# Altium schematic sheet 2020-10-26_19-15-181.schdoc
size 425 x 137 mm; SheetNumber: 1; SheetTotal: 1
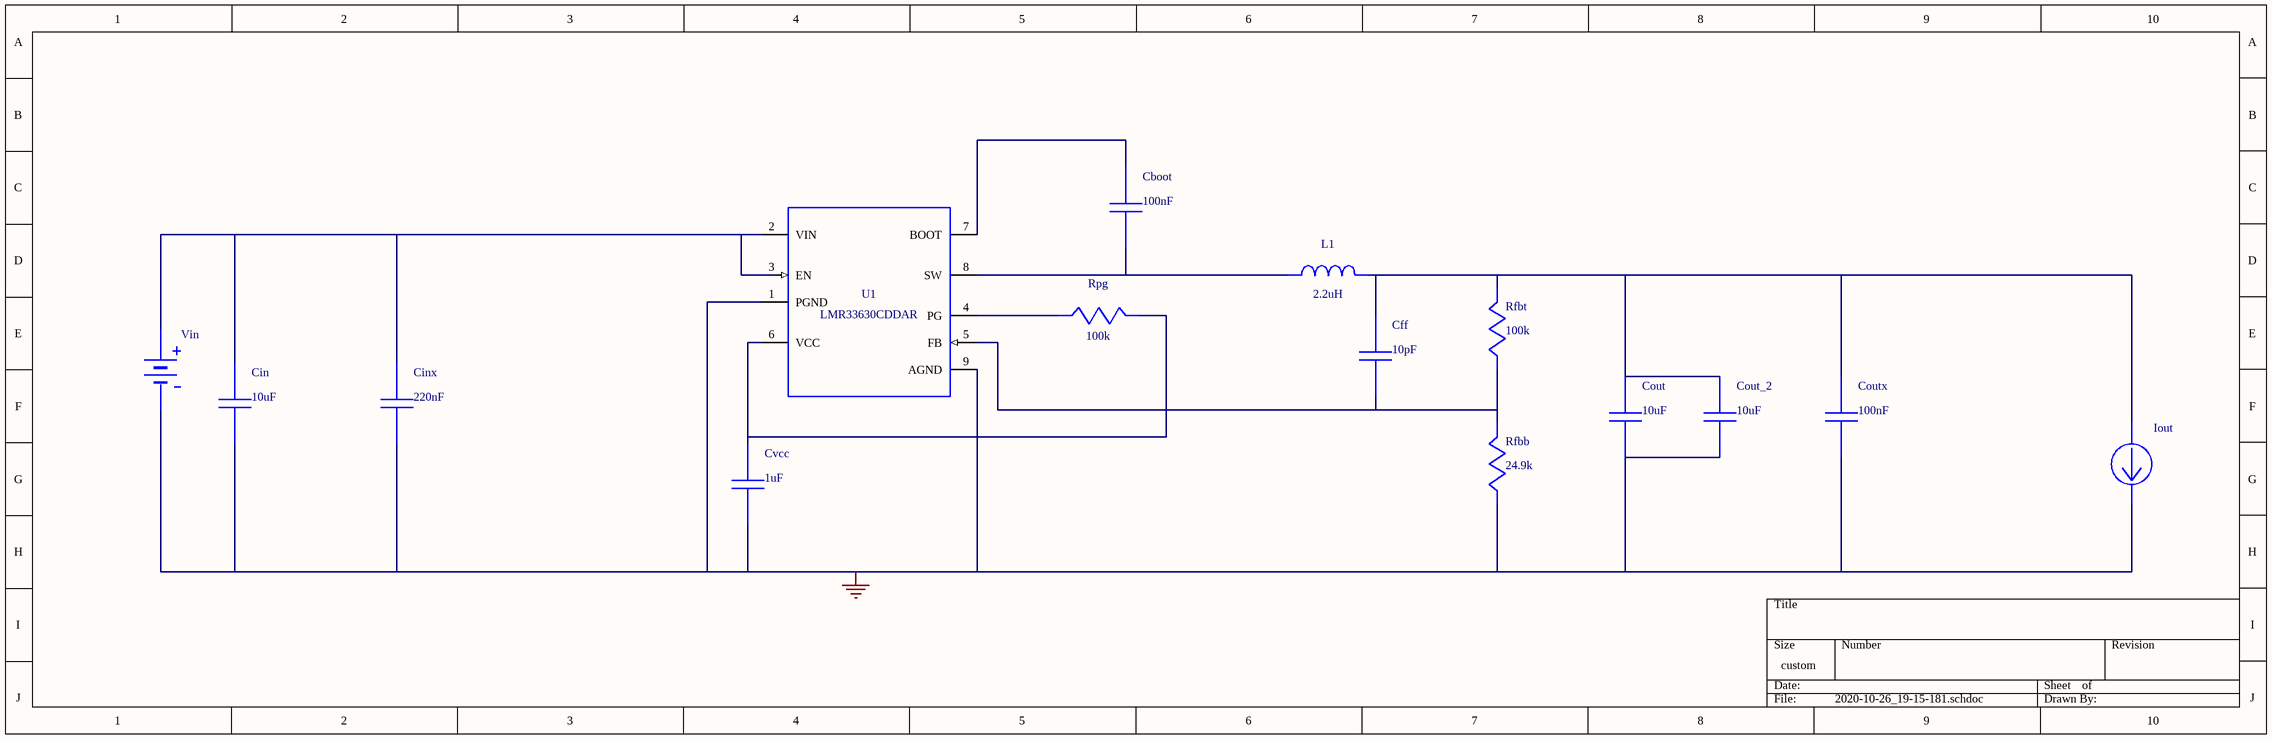
[diagram p0: 2020-10-26_19-15-181.schdoc]

## Parts
Cboot  value 100nF  (hidden comment: GRM155R71C104KA88D)
Cff  value 10pF  (hidden comment: C0402C100J3GACTU)
Cin  value 10uF  (hidden comment: C3225X7R1H106M250AC)
Cinx  value 220nF  (hidden comment: C2012X7R1H224K125AA)
Cout  value 10uF  (hidden comment: C0805C106K8PACTU)
Cout_2  value 10uF  (hidden comment: C0805C106K8PACTU)
Coutx  value 100nF  (hidden comment: GRM188R71E104KA01D)
Cvcc  value 1uF  (hidden comment: C0603C105K8PACTU)
Iout  WB_CURRENT_LOAD  (value not drawn)
L1  value 2.2uH  (hidden comment: VLP8040T-2R2N)
Rfbb  value 24.9k  (hidden comment: CRCW040224K9FKED)
Rfbt  value 100k  (hidden comment: CRCW0402100KFKED)
Rpg  value 100k  (hidden comment: CRCW0402100KFKED)
U1  LMR33630CDDAR
Vin  WB_BATTERY  (value not drawn)

## Nets
0: Cin.2 Cinx.2 Cout.2 Cout_2.2 Coutx.2 Cvcc.2 Iout.2(-) Rfbb.2 U1.1(PGND) U1.9(AGND) Vin.2(-)
NetCboot_1: Cboot.1 U1.7(BOOT)
NetCboot_2: Cboot.2 L1.1 U1.8(SW)
NetCff_1: Cff.1 Cout.1 Cout_2.1 Coutx.1 Iout.1(+) L1.2 Rfbt.1
NetCff_2: Cff.2 Rfbb.1 Rfbt.2 U1.5(FB)
NetCin_1: Cin.1 Cinx.1 U1.2(VIN) U1.3(EN) Vin.1(+)
NetCvcc_1: Cvcc.1 Rpg.1 U1.6(VCC)
NetRpg_2: Rpg.2 U1.4(PG)

## Library data of the parts
Cboot = GRM155R71C104KA88D: GRM155R71C104KA8; Manufacturer Name: MuRata; PackageReference: GRM155R71C104KA88D; Manufacturer Part Number: GRM155R71C104KA88D
Cff = C0402C100J3GACTU: Manufacturer Name: Kemet; PackageReference: C0402C100J3GACTU; Manufacturer Part Number: C0402C100J3GACTU
Cin = C3225X7R1H106M250AC: C3225X7R1H106M25; Manufacturer Name: TDK; PackageReference: C3225X7R1H106M250AC; Manufacturer Part Number: C3225X7R1H106M250AC
Cinx = C2012X7R1H224K125AA: C2012X7R1H224K12; Manufacturer Name: TDK; PackageReference: C2012X7R1H224K125AA; Manufacturer Part Number: C2012X7R1H224K125AA
Cout Cout_2 = C0805C106K8PACTU: Manufacturer Name: Kemet; PackageReference: C0805C106K8PACTU; Manufacturer Part Number: C0805C106K8PACTU
Coutx = GRM188R71E104KA01D: GRM188R71E104KA0; Manufacturer Name: MuRata; PackageReference: GRM188R71E104KA01D; Manufacturer Part Number: GRM188R71E104KA01D
Cvcc = C0603C105K8PACTU: Manufacturer Name: Kemet; PackageReference: C0603C105K8PACTU; Manufacturer Part Number: C0603C105K8PACTU
L1 = VLP8040T-2R2N: Unknown; Manufacturer Name: TDK; PackageReference: VLP8040T-2R2N; Manufacturer Part Number: VLP8040T-2R2N
Rfbb = CRCW040224K9FKED: Manufacturer Name: Vishay-Dale; PackageReference: CRCW040224K9FKED; Manufacturer Part Number: CRCW040224K9FKED
Rfbt Rpg = CRCW0402100KFKED: Manufacturer Name: Vishay-Dale; PackageReference: CRCW0402100KFKED; Manufacturer Part Number: CRCW0402100KFKED
U1 = LMR33630CDDAR: Manufacturer Name: Texas Instruments; PackageReference: LMR33630CDDAR; Manufacturer Part Number: LMR33630CDDAR; Value: N/A
Iout = WB_CURRENT_LOAD: PackageReference: WB_CURRENT_LOAD; Manufacturer Part Number: WB_CURRENT_LOAD; Manufacturer Name: WB_CURRENT_LOAD; Value: N/A
Vin = WB_BATTERY: PackageReference: WB_BATTERY; Manufacturer Part Number: WB_BATTERY; Manufacturer Name: WB_BATTERY; Value: N/A